# EAGLE design working (EAGLE 9.6.2)
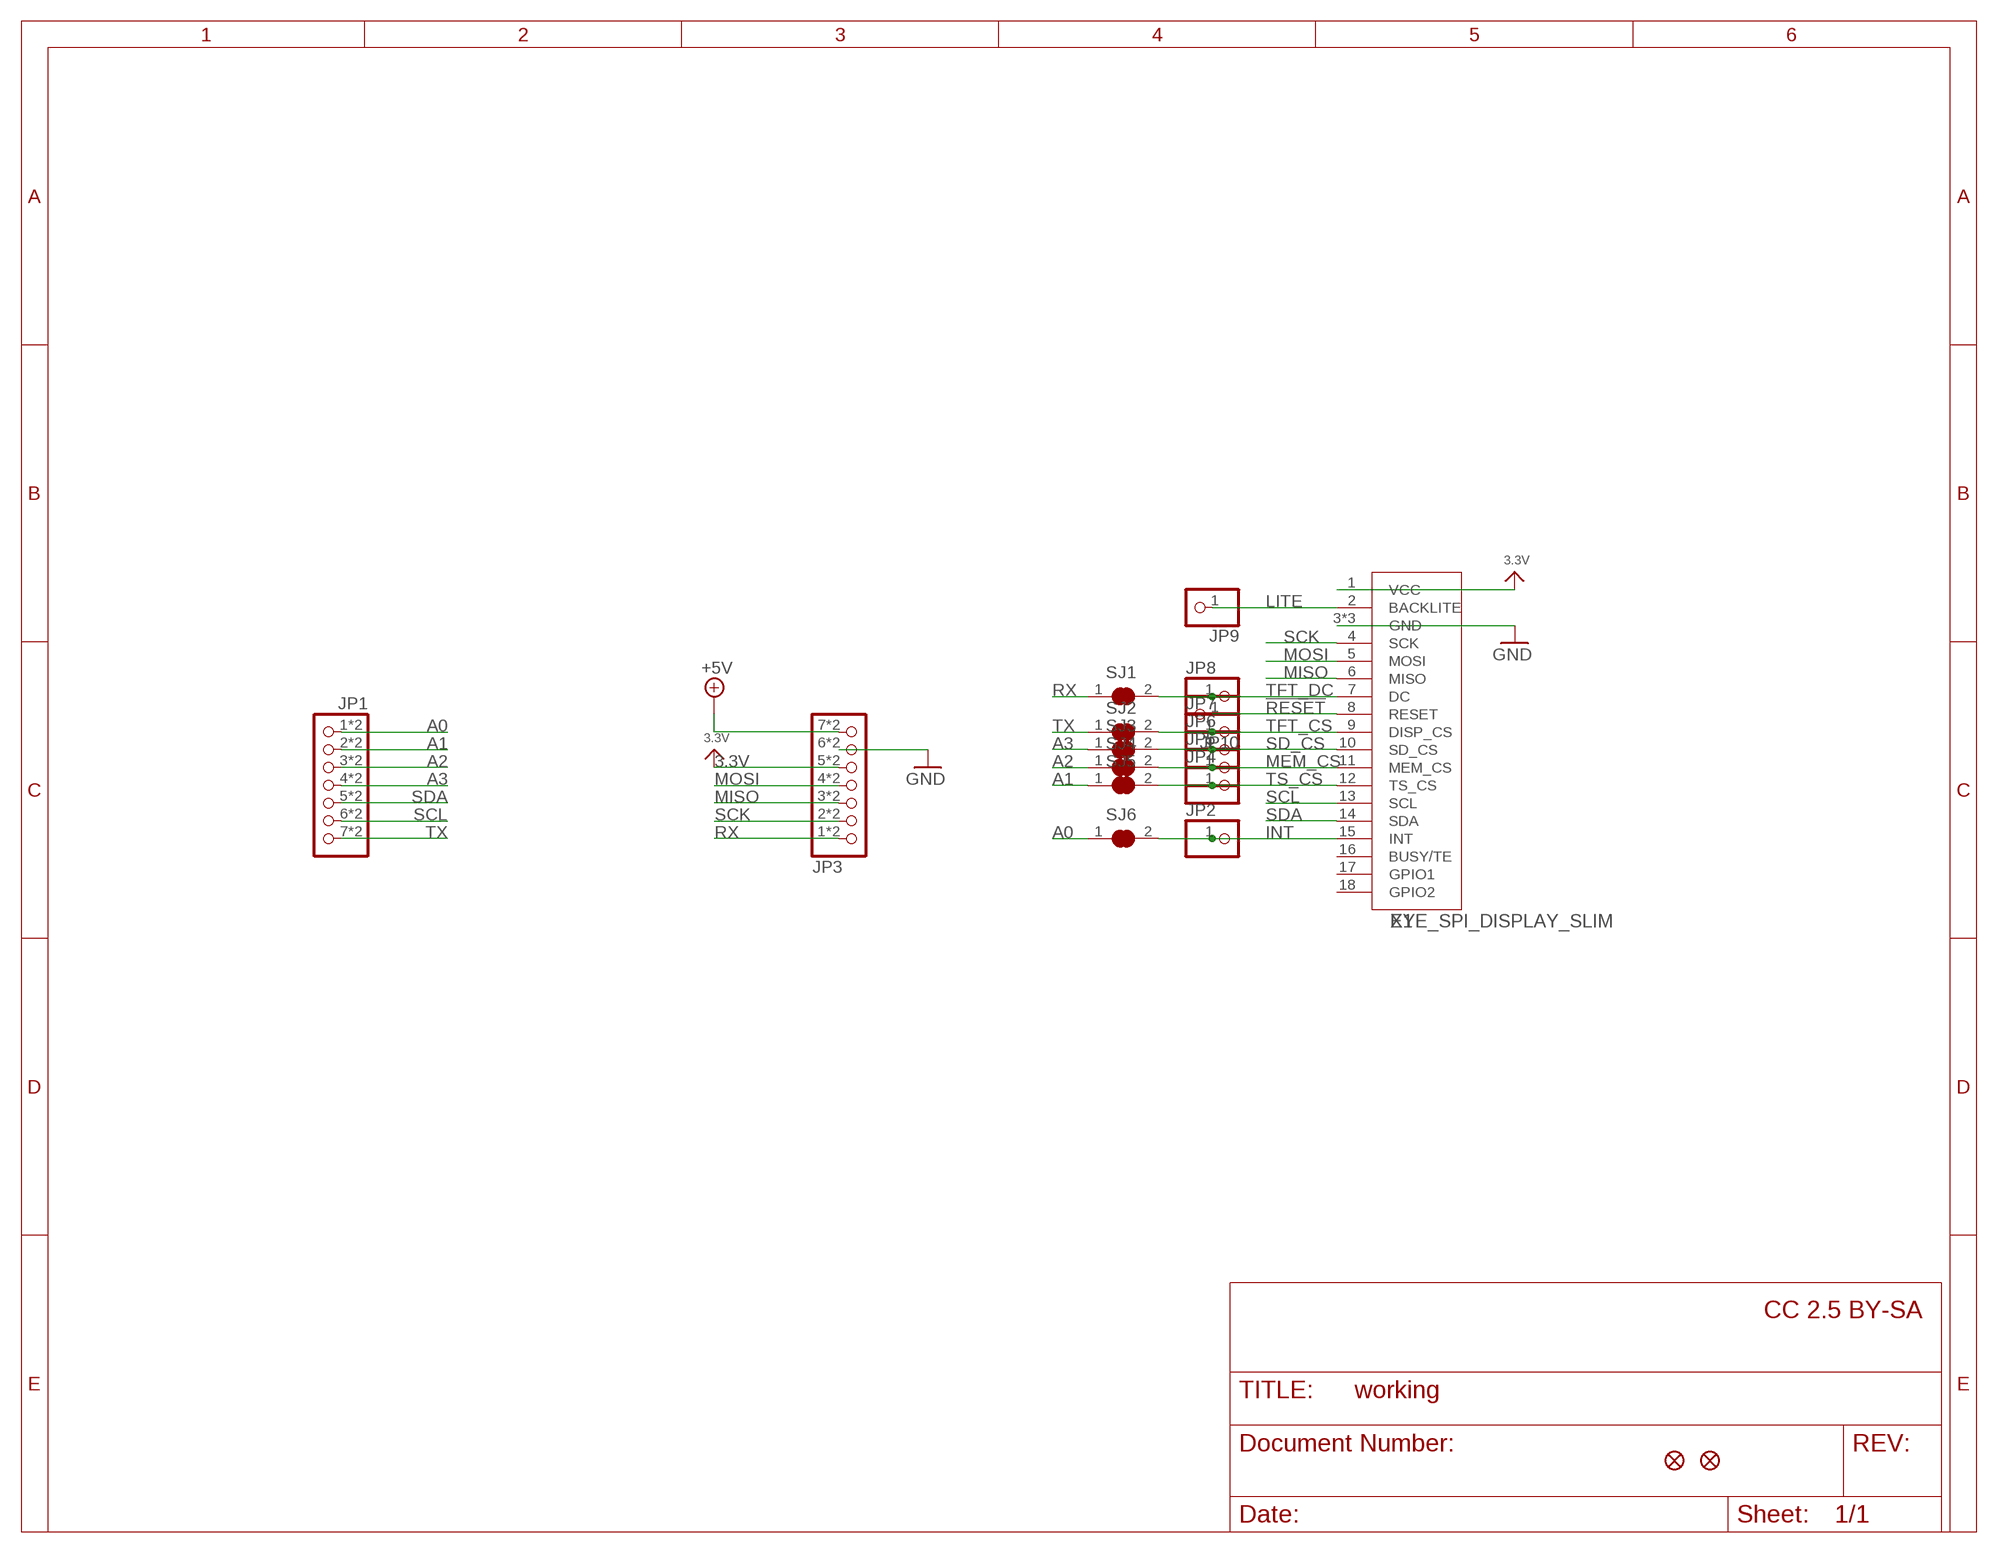
[diagram p0: schematic, sheet 1]

## Parts
JP1  HEADER-1X7_CASTEL  [1X07_CASTEL]
JP2  HEADER-1X12MM  [1X01_2MM]
JP3  HEADER-1X7_CASTEL  [1X07_CASTEL]
JP4  HEADER-1X12MM  [1X01_2MM]
JP5  HEADER-1X12MM  [1X01_2MM]
JP6  HEADER-1X12MM  [1X01_2MM]
JP7  HEADER-1X12MM  [1X01_2MM]
JP8  HEADER-1X12MM  [1X01_2MM]
JP9  HEADER-1X12MM  [1X01_2MM]
JP10  HEADER-1X12MM  [1X01_2MM]
SJ1  SOLDERJUMPER_CLOSED  [SOLDERJUMPER_CLOSEDWIRE]
SJ2  SOLDERJUMPER_CLOSED  [SOLDERJUMPER_CLOSEDWIRE]
SJ3  SOLDERJUMPER_CLOSED  [SOLDERJUMPER_CLOSEDWIRE]
SJ4  SOLDERJUMPER_CLOSED  [SOLDERJUMPER_CLOSEDWIRE]
SJ5  SOLDERJUMPER_CLOSED  [SOLDERJUMPER_CLOSEDWIRE]
SJ6  SOLDERJUMPER_CLOSED  [SOLDERJUMPER_CLOSEDWIRE]
U$6  FIDUCIAL_1MM  [FIDUCIAL_1MM]
U$8  FIDUCIAL_1MM  [FIDUCIAL_1MM]
X1  EYE_SPI_DISPLAY_SLIM  [EYE_SPI_DISPLAY_SLIM]

## Nets
3.3V [power]: JP3.5 JP3.5C X1.1(VCC)
!RESET: JP10.1 X1.8(RESET)
+5V [power]: JP3.7 JP3.7C
A0: JP1.1 JP1.1C SJ6.1
A1: JP1.2 JP1.2C SJ5.1
A2: JP1.3 JP1.3C SJ4.1
A3: JP1.4 JP1.4C SJ3.1
GND [power]: JP3.6 JP3.6C X1.3(GND) X1.SUPPORT1(GND) X1.SUPPORT2(GND)
INT: JP2.1 SJ6.2 X1.15(INT)
LITE: JP9.1 X1.2(BACKLITE)
MEM_CS: JP5.1 SJ4.2 X1.11(MEM_CS)
MISO: JP3.3 JP3.3C X1.6(MISO)
MOSI: JP3.4 JP3.4C X1.5(MOSI)
RX: JP3.1 JP3.1C SJ1.1
SCK: JP3.2 JP3.2C X1.4(SCK)
SCL: JP1.6 JP1.6C X1.13(SCL)
SD_CS: JP6.1 SJ3.2 X1.10(SD_CS)
SDA: JP1.5 JP1.5C X1.14(SDA)
TFT_CS: JP7.1 SJ2.2 X1.9(DISP_CS)
TFT_DC: JP8.1 SJ1.2 X1.7(DC)
TS_CS: JP4.1 SJ5.2 X1.12(TS_CS)
TX: JP1.7 JP1.7C SJ2.1
Unconnected: X1.16(BUSY/TE) X1.17(GPIO1) X1.18(GPIO2)

## Notes on the sheet
- CC 2.5 BY-SA

## Library data of the parts
JP1 JP3 = adafruit_electromech:HEADER-1X7: PIN HEADER
JP2 JP4-JP10 = microbuilder:HEADER-1X1: PIN HEADER
SJ1-SJ6 = microbuilder:SOLDERJUMPER_CLOSED: Solder Jumper - Closed These solder jumpers are closed by default CLOSEDWIRE - 10 mil trace between pads that can be cut and resoldered later CLOSEDPERM - 63 mil trace between pads for a permanent connection (used to 'bridge' two signals, a shameless hack for Eagle). Can double as a test point as well (no cream layer)
U$6 U$8 = microbuilder:FIDUCIAL: Fiducial Alignment Points Various fiducial points for machine vision alignment.; BOM: EXCLUDE
X1 = adafruit_display:EYE_SPI_DISPLAY

## Net classes
1 power: width 0.305 mm
2 thickpower: width 0.406 mm

## Board
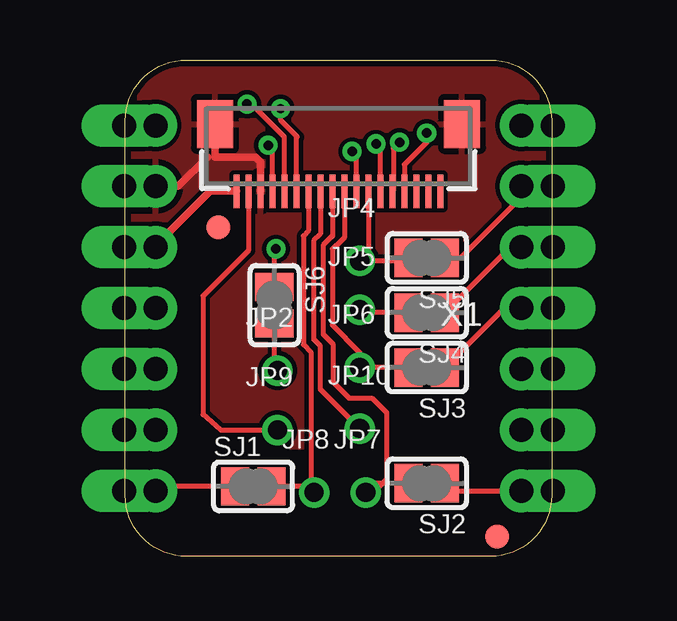
[diagram p1: board, top side]
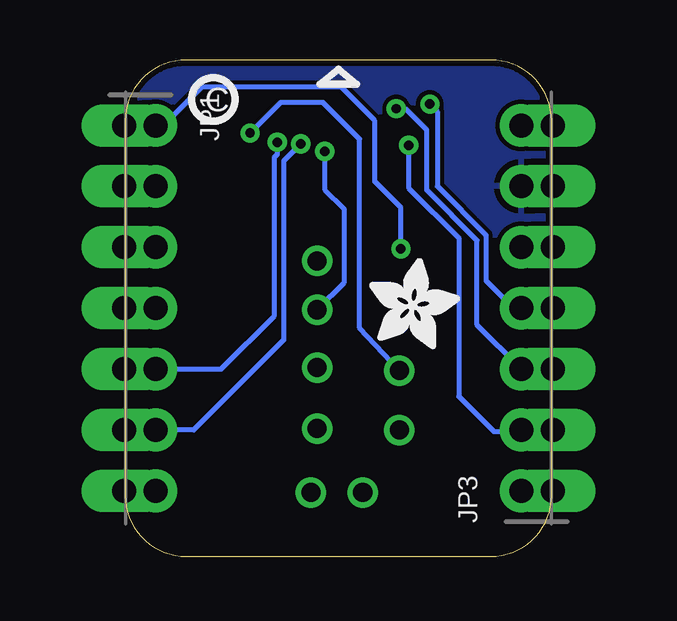
[diagram p2: board, bottom side, seen from below]

Size 17.78 x 20.7 mm. Coordinates in mm from the lower left corner, seen from the top.
Outline: 17.78,18.16 17.78,2.54 arc-90 15.24,0 2.54,0 arc-90 0,2.54 0,18.16 arc-90 2.54,20.7 15.24,20.7 arc-90 17.78,18.16
Copper layers (1*16): Top 0.035mm / dielectric 1.5mm / Bottom 0.035mm
Design rules "adafruit 7-7": minimum track width 7mil, minimum drill 15.5mil, track to track 7mil, track to pad 7mil, pad to pad 7mil, via to via 7mil, smd to smd 7mil, copper to edge 10mil, drill to drill 8mil, minimum pad ring 7mil, minimum via ring 8mil, stop-mask expansion 2mil, vias tented up to drill 20mil, thermal gap 10mil

### Footprints (pad centres in the part's own frame; a part is rotated, then mirrored left to right if it is on the bottom)
1X07_CASTEL = drill 1 pad 1.778: 1 -7.62,0; 2 -5.08,0; 3 -2.54,0; 4 0,0; 5 2.54,0; 6 5.08,0; 7 7.62,0 | drill 1 pad 1.778 long: 1C -7.62,-1.324; 2C -5.08,-1.324; 3C -2.54,-1.324; 4C 0,-1.324; 5C 2.54,-1.324; 6C 5.08,-1.324; 7C 7.62,-1.324
1X01_2MM = drill 0.8 pad 1.27: 1 0,0
SOLDERJUMPER_CLOSEDWIRE = smd 1.168 x 1.6: 1 -0.762,0; 2 0.762,0 | smd 0.635 x 0.203: WIRE 0,0
FIDUCIAL_1MM = smd 1 x 1: 1 0,0
EYE_SPI_DISPLAY_SLIM = smd 0.25 x 1.4: 1 4.25,1.154; 2 3.75,1.154; 3 3.25,1.154; 4 2.75,1.154; 5 2.25,1.154; 6 1.75,1.154; 7 1.25,1.154; 8 0.75,1.154; 9 0.25,1.154; 10 -0.25,1.154; 11 -0.75,1.154; 12 -1.25,1.154; 13 -1.75,1.154; 14 -2.25,1.154; 15 -2.75,1.154; 16 -3.25,1.154; 17 -3.75,1.154; 18 -4.25,1.154 | smd 1.5 x 2: SUPPORT1 -5.15,-1.65; SUPPORT2 5.15,-1.65

### Placement (x,y rotation side)
JP1  16.51,10.35 270 bottom
JP2  6.35,7.75 0 top
JP3  1.27,10.35 90 bottom
JP4  9.78,12.32 0 top
JP5  9.78,10.29 0 top
JP6  9.78,7.87 0 top
JP7  10.03,2.67 0 top
JP8  7.87,2.67 0 top
JP9  6.35,5.27 0 top
JP10  9.78,5.33 0 top
PLABEL1  [PLABEL1]  14.99,2.54 90 top
PLABEL2  [PLABEL2]  14.22,5.33 0 top
PLABEL3  [PLABEL3]  1.84,19.56 0 top
PLABEL4  [PLABEL4]  14.86,14.73 0 top
PLABEL5  [PLABEL5]  14.99,12.83 90 top
PLABEL6  [PLABEL6]  16,19.56 0 top
PLABEL7  [PLABEL7]  14.99,10.29 90 top
PLABEL8  [PLABEL8]  2.79,14.92 90 top
PLABEL9  [PLABEL9]  3.24,12.26 0 top
PLABEL10  [PLABEL10]  3.62,10.29 0 top
PLABEL11  [PLABEL11]  3.24,7.75 0 top
PLABEL12  [PLABEL12]  14.99,7.62 90 top
PLABEL13  [PLABEL13]  3.75,5.33 0 top
PLABEL14  [PLABEL14]  2.92,2.73 90 top
PLABEL19  [PLABEL19]  9.02,18.35 0 bottom
PLABEL20  [PLABEL20]  9.33,13.65 0 top
PLABEL21  [PLABEL21]  9.59,6.6 0 top
PLABEL22  [PLABEL22]  6.41,6.54 0 top
PLABEL23  [PLABEL23]  8.45,10.16 90 top
PLABEL24  [PLABEL24]  8,4 0 top
PLABEL25  [PLABEL25]  9.84,4 0 top
PLABEL26  [PLABEL26]  8.32,0.89 0 top
PLABEL27  [PLABEL27]  11.87,5.21 0 top
PLABEL28  [PLABEL28]  8.06,5.33 0 top
PLABEL29  [PLABEL29]  12.38,12.19 0 bottom
PLABEL30  [PLABEL30]  13.02,10.35 0 bottom
PLABEL31  [PLABEL31]  12.64,7.87 0 bottom
PLABEL32  [PLABEL32]  12.76,5.4 0 bottom
PLABEL33  [PLABEL33]  4.45,7.68 0 bottom
PLABEL34  [PLABEL34]  11.81,2.67 0 bottom
PLABEL35  [PLABEL35]  6.1,2.73 0 bottom
PLABEL36  [PLABEL36]  4.13,5.33 0 bottom
PLABEL37  [PLABEL37]  8.51,14.99 0 bottom
SJ1  5.33,2.92 0 top
SJ2  12.57,3.05 180 top
SJ3  12.57,7.87 180 top
SJ4  12.57,10.16 180 top
SJ5  12.57,12.45 180 top
SJ6  6.22,10.48 270 top
U$2  [ADAFRUIT_3.5MM]  7.62,8.64 0 bottom
U$3  [PCBFEAT-REV-040]  14.1,19.05 0 bottom
U$6  15.51,0.83 0 top
U$8  3.87,13.72 0 top
X1  8.89,16.38 180 top

### Tracks (layer width: path | path; a pad name or v marks a point on that pad's centre or on a via)
3.3V
  Top 0.305: JP3.5C JP3.5 1.27,12.95 3.54,15.23 X1.1
!RESET
  Top 0.203: X1.8 8.14,13.45 7.86,13.17 7.86,9.06 8.13,8.79 8.13,6.99 JP10.1
+5V
  Top 0.305: JP3.7C JP3.7
A0  (via drill 0.39)
  Top 0.203: JP1.1C JP1.1 | SJ6.1 6.22,12.76 v6.29,12.83
  Bottom 0.203: v6.29,12.83 6.29,14.54 7.37,15.62 7.37,18.16 8.76,19.56 14.61,19.56 16.19,17.97 JP1.1
A1
  Top 0.203: SJ5.1 13.97,12.45 16.51,14.99 JP1.2 JP1.2C
A2
  Top 0.203: JP1.3 JP1.3C 16.07,12.89 SJ4.1
A3
  Top 0.203: SJ3.1 15.81,10.35 JP1.4 JP1.4C
GND
  Top 0.305: X1.3 5.64,16.43 5.43,16.65 3.74,16.65 X1.SUPPORT2 | JP3.6 JP3.6C 2.21,15.43 3.43,16.65
  pour Top: 0,20.7 17.78,20.7 17.78,4.57 0,4.57
  pour Bottom: 0,20.7 17.78,20.7 17.78,4.57 0,4.57
INT  (via drill 0.39)
  Top 0.203: JP2.1 6.22,7.87 SJ6.2 | v12.57,17.65 12.57,17.27 11.64,16.34 X1.15
  Bottom 0.203: JP2.1 8,9.53 8,17.4 9.53,18.92 11.3,18.92 v12.57,17.65
LITE
  Top 0.203: X1.2 5.14,12.76 3.24,10.86 3.24,5.92 3.98,5.27 JP9.1
MEM_CS  (via drill 0.39)
  Top 0.203: SJ4.2 9.91,10.16 JP5.1 | X1.11 9.64,16.71 v9.46,16.89
  Bottom 0.203: v9.46,16.89 9.46,15.3 8.66,14.5 8.66,11.4 JP5.1
MISO  (via drill 0.39)
  Top 0.203: JP3.3C JP3.3 | X1.6 7.14,17.45 7.18,17.49 6.48,18.19 v6.48,18.67
  Bottom 0.203: JP3.3 3.11,9.65 3.11,13.18 5.21,15.27 5.21,17.78 6.1,18.67 v6.48,18.67
MOSI  (via drill 0.39)
  Top 0.203: JP3.4C JP3.4 | X1.5 6.64,17.49 5.27,18.86 v5.08,18.86
  Bottom 0.203: JP3.4 1.59,10.35 2.73,11.49 2.73,13.4 4.76,15.43 4.76,18.54 v5.08,18.86
RX
  Top 0.203: JP3.1C JP3.1 1.46,2.92 SJ1.1
SCK  (via drill 0.39)
  Top 0.203: X1.4 6.14,16.97 v5.96,17.14 | JP3.2C JP3.2
  Bottom 0.203: v5.96,17.14 5.96,15.37 3.87,13.28 3.87,6.67 2.41,5.21 1.33,5.21 JP3.2
SCL  (via drill 0.39)
  Top 0.203: X1.13 10.64,17.02 v10.46,17.2
  Top 0.305: JP1.6C JP1.6
  Bottom 0.203: v10.46,17.2 11.18,16.49 11.18,9.02 14.92,5.27 JP1.6
SD_CS
  Top 0.203: SJ3.2 JP6.1 9.78,8.51 8.64,9.65 8.64,12.82 8.76,12.95 8.8,12.95 9.14,13.29 X1.10
SDA  (via drill 0.39)
  Top 0.203: v11.44,17.27 11.18,17.01 11.18,15.27 X1.14
  Top 0.305: JP1.5C JP1.5
  Bottom 0.203: JP1.5 13.78,7.81 11.56,10.03 11.56,16.64 11.44,16.76 v11.44,17.27
TFT_CS
  Top 0.203: SJ2.2 10.41,3.05 JP7.1 10.34,2.67 10.9,3.22 10.9,5.99 10.29,6.6 9.32,6.6 8.66,7.26 8.66,8.87 8.26,9.27 8.26,12.98 8.61,13.33 8.64,13.33 X1.9
TFT_DC
  Top 0.203: 7.75,2.92 SJ1.2 | X1.7 7.64,13.58 7.43,13.37 7.43,8.83 7.75,8.51 7.75,2.92 | 7.75,2.92 7.75,2.79 JP8.1
TS_CS
  Top 0.203: X1.12 10.14,12.68 JP4.1 11.68,12.32 SJ5.2
TX
  Top 0.203: SJ2.1 13.65,2.73 JP1.7
  Top 0.305: JP1.7C JP1.7

### Text on the board
Pinguin_tBackup: 5V | A0 | A1 | G | 3V | TCS | S | A2 | - | MCS | A3 | MO | + | MI | INT | SCS | SDA | SCK | LIT | RST | SCL | DC | CS | RX | Sig | TX | EYESPI QT PY | NeoPixel BFF
Pinguin_bBackup: USB | EYESPI BFF / for QT Py | NeoPixel Driver / Neo+ <-> 5V / QT Py. Solder / back to back / Signal on A3 | TS CS | MEMCS | INT | SD CS | LITE | RESET | DC | CS